# Altium project XH发衣柜.PrjPcb
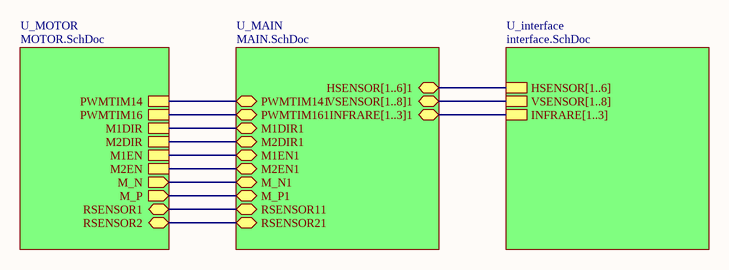
[diagram p0: NETPAGE1.SchDoc]
3 sheets, 77 parts. Net scope: hierarchical (ports join the sheet entries above them; power ports are global).
Board file: XH发衣柜.PcbDoc
Sheets:
  NETPAGE1.SchDoc
    U_MOTOR = MOTOR.SchDoc
    U_MAIN = MAIN.SchDoc

## Sheet NETPAGE1.SchDoc
size A4

### Sub-sheets
U_interface = interface.SchDoc (file not in this document): HSENSOR[1..6], VSENSOR[1..8], INFRARE[1..3]
U_MAIN = MAIN.SchDoc: HSENSOR[1..6]1, VSENSOR[1..8]1, PWMTIM141, PWMTIM161, M1DIR1, M2DIR1, M1EN1, M2EN1, M_N1, M_P1, INFRARE[1..3]1, RSENSOR11, RSENSOR21
U_MOTOR = MOTOR.SchDoc: M2DIR, M1DIR, PWMTIM14, PWMTIM16, M1EN, M2EN, M_N, M_P, RSENSOR1, RSENSOR2

### Nets
M1DIR: sheet U_MOTOR/M1DIR, sheet U_MAIN/M1DIR1
M1EN: sheet U_MOTOR/M1EN, sheet U_MAIN/M1EN1
M2DIR: sheet U_MOTOR/M2DIR, sheet U_MAIN/M2DIR1
M2EN: sheet U_MOTOR/M2EN, sheet U_MAIN/M2EN1
M_N: sheet U_MOTOR/M_N, sheet U_MAIN/M_N1
M_P: sheet U_MOTOR/M_P, sheet U_MAIN/M_P1
PWMTIM14: sheet U_MOTOR/PWMTIM14, sheet U_MAIN/PWMTIM141
PWMTIM16: sheet U_MOTOR/PWMTIM16, sheet U_MAIN/PWMTIM161
RSENSOR1: sheet U_MOTOR/RSENSOR1, sheet U_MAIN/RSENSOR11
RSENSOR2: sheet U_MOTOR/RSENSOR2, sheet U_MAIN/RSENSOR21

### Buses and harness runs
bus sheet U_interface/HSENSOR[1..6] = sheet U_MAIN/HSENSOR[1..6]1
bus sheet U_interface/INFRARE[1..3] = sheet U_MAIN/INFRARE[1..3]1
bus sheet U_interface/VSENSOR[1..8] = sheet U_MAIN/VSENSOR[1..8]1

## Sheet MOTOR.SchDoc
size A3
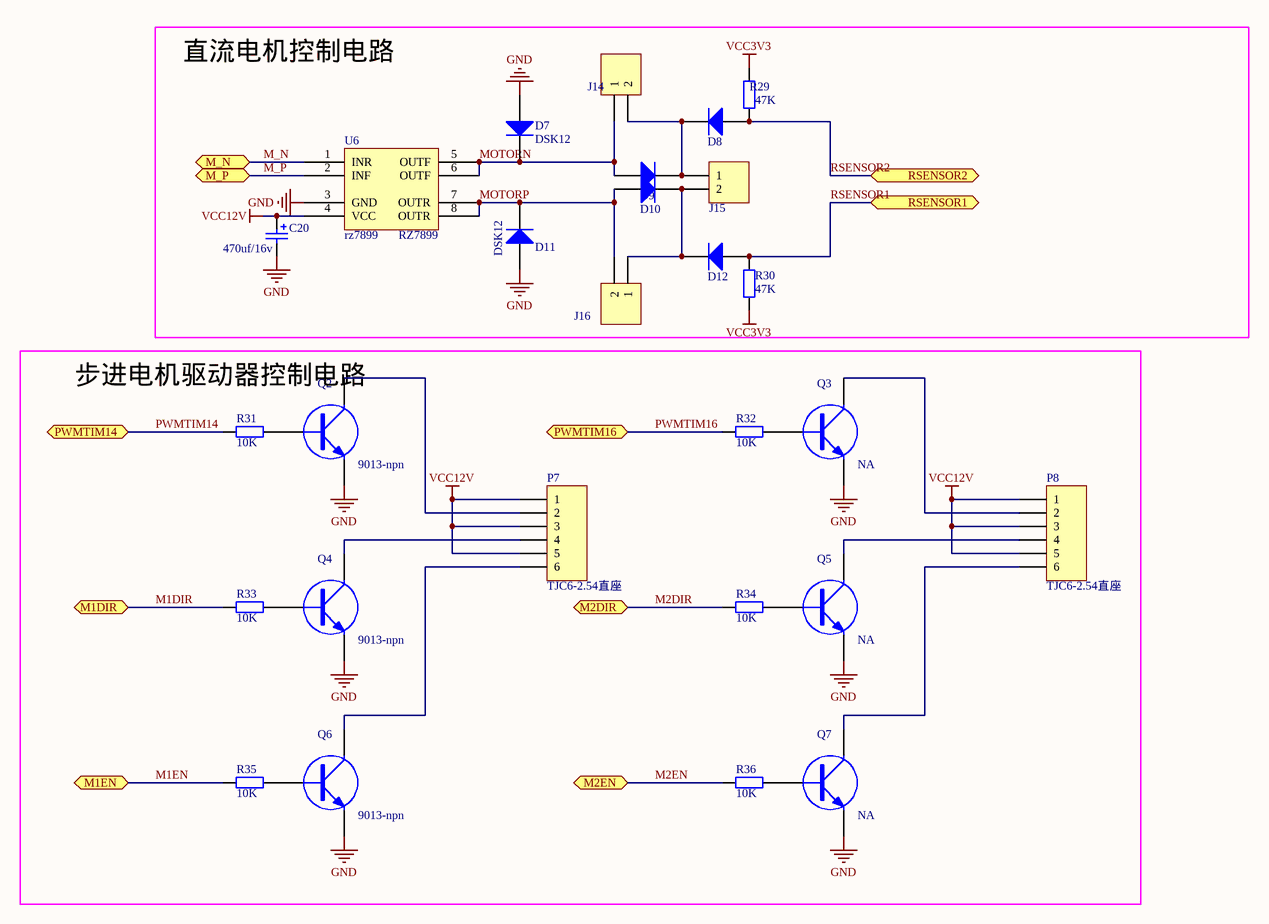
[diagram p1: MOTOR.SchDoc]

### Parts
C20  470uf/16v  [cap_470/16v]
D7  型号: DSK12  [SOD123_D]  (hidden comment: Diode_SOD523)
D8  Diode_SOD323  [SOD323_D]  (value not drawn)
D9  Diode_DO214AB  [SOD123-F]  (value not drawn)
D10  Diode_DO214AB  [SOD123-F]  (value not drawn)
D11  型号: DSK12  [SOD123_D]  (hidden comment: Diode_SOD523)
D12  Diode_SOD323  [SOD323_D]  (value not drawn)
J14  XHB2.54-2PIN-带锁扣  [SIP2]  (value not drawn)
J15  XHB2.54-2PIN-带锁扣  [SIP2]  (value not drawn)
J16  XHB2.54-2PIN-带锁扣  [SIP2]  (value not drawn)
P7  TJC6-2.54直座  [SIP6]
P8  TJC6-2.54直座  [SIP6]
Q2  型号: 9013-npn  [SOT23]  (hidden comment: NPN_SOT23)
Q3  型号: NA  [SOT23]  (hidden comment: NPN_SOT23)
Q4  型号: 9013-npn  [SOT23]  (hidden comment: NPN_SOT23)
Q5  型号: NA  [SOT23]  (hidden comment: NPN_SOT23)
Q6  型号: 9013-npn  [SOT23]  (hidden comment: NPN_SOT23)
Q7  型号: NA  [SOT23]  (hidden comment: NPN_SOT23)
R29  型号: 47K  [0603R]  (hidden comment: Res_0603)
R30  型号: 47K  [0603R]  (hidden comment: Res_0603)
R31  型号: 10K  [0603R]  (hidden comment: Res_0603)
R32  型号: 10K  [0603R]  (hidden comment: Res_0603)
R33  型号: 10K  [0603R]  (hidden comment: Res_0603)
R34  型号: 10K  [0603R]  (hidden comment: Res_0603)
R35  型号: 10K  [0603R]  (hidden comment: Res_0603)
R36  型号: 10K  [0603R]  (hidden comment: Res_0603)
U6  rz7899  [SOP_8]

### Blocks framed on the sheet
直流电机控制电路: C20 D7-D12 J14-J16 R29 R30 U6
步进电机驱动器控制电路: P7 P8 Q2-Q7 R31-R36

### Ports
M1DIR, M1EN, M2DIR, M2EN, M_N, M_P, PWMTIM14, PWMTIM16, RSENSOR1, RSENSOR2

### Nets
GND: C20.2 D7.1 D11.1 Q2.2(E) Q3.2(E) Q4.2(E) Q5.2(E) Q6.2(E) Q7.2(E) U6.3(GND)
VCC3V3: R29.2 R30.1
VCC12V: C20.1 P7.1 P7.3 P7.5 P8.1 P8.3 P8.5 U6.4(VCC)
M1DIR: R33.1 ; port M1DIR
M1EN: R35.1 ; port M1EN
M2DIR: R34.1 ; port M2DIR
M2EN: R36.1 ; port M2EN
M_N: U6.1(INR) ; port M_N
M_P: U6.2(INF) ; port M_P
MOTORN: D7.2 D9.1 J14.1 U6.5(OUTF) U6.6(OUTF)
MOTORP: D10.1 D11.2 J16.2 U6.7(OUTR) U6.8(OUTR)
PWMTIM14: R31.1 ; port PWMTIM14
PWMTIM16: R32.1 ; port PWMTIM16
RSENSOR1: D12.1 R30.2 ; port RSENSOR1
RSENSOR2: D8.1 R29.1 ; port RSENSOR2
NetD8_2: D8.2 D9.2 J14.2 J15.1
NetD10_2: D10.2 D12.2 J15.2 J16.1
NetP7_2: P7.2 Q2.3(C)
NetP7_4: P7.4 Q4.3(C)
NetP7_6: P7.6 Q6.3(C)
NetP8_2: P8.2 Q3.3(C)
NetP8_4: P8.4 Q5.3(C)
NetP8_6: P8.6 Q7.3(C)
NetQ2_1: Q2.1(B) R31.2
NetQ3_1: Q3.1(B) R32.2
NetQ4_1: Q4.1(B) R33.2
NetQ5_1: Q5.1(B) R34.2
NetQ6_1: Q6.1(B) R35.2
NetQ7_1: Q7.1(B) R36.2

### Library data of the parts
C20 = Cap_直插470uf/16v: Polarized Capacitor (Radial); 名称: 贴片电容; 容差: 20%; 型号: 470UF/16V电容; 参考网址: *
D7 D11 = Diode_SOD523: Default Diode; 名称: 贴片二极管; 容差: *
D8 D12 = Diode_SOD323: Default Diode; Published: 8-Jun-2000; LatestRevisionDate: 17-Jul-2002; LatestRevisionNote: Re-released for DXP Platform.; PackageVersion: Sep-1996; PackageReference: SMC; Publisher: Altium Limited; PackageDescription: DO-214-AB/SMC; 2 C-Bend Leads; Body 7.9 x 5.9 mm, inc. leads (LxW); Code_JEDEC: DO-214-AB
D9 D10 = Diode_DO214AB: Default Diode; Published: 8-Jun-2000; LatestRevisionDate: 17-Jul-2002; LatestRevisionNote: Re-released for DXP Platform.; PackageVersion: Sep-1996; PackageReference: SMC; Publisher: Altium Limited; PackageDescription: DO-214-AB/SMC; 2 C-Bend Leads; Body 7.9 x 5.9 mm, inc. leads (LxW); Code_JEDEC: DO-214-AB
J14-J16 = XHB2.54-2P直座: Header, 4-Pin; 名称: 插接件; 容差: *; 参考网址: *; 型号: XHB2.54-2PIN-带锁扣
P7 = TJC6-2.54直座: Header, 6-Pin; 名称: 插接件; 型号: XHB2.54-6PIN-直插锁扣座; 容差: *; 参考网址: https://item.taobao.com/item.htm?spm=a230r.1.14.16.ebb2eb2XgBFau&id=536742831564&ns=1&abbucket=6#detail
P8 = TJC6-2.54直座: Header, 6-Pin; 名称: 插接件; 型号: NA; 容差: *; 参考网址: *
Q2-Q7 = NPN_SOT23: NPN Bipolar Transistor; 名称: 集成电路; 容差: *; 参考网址: *
R29-R36 = Res_0603: Resistor; 名称: 贴片电阻; 容差: 5%; 参考网址: *
U6 = rz7899: 电机驱动芯片3-25V 5A; 名称: 集成芯片; 型号: RZ7899; 容差: *; 参考网址: *

## Sheet MAIN.SchDoc
size A2
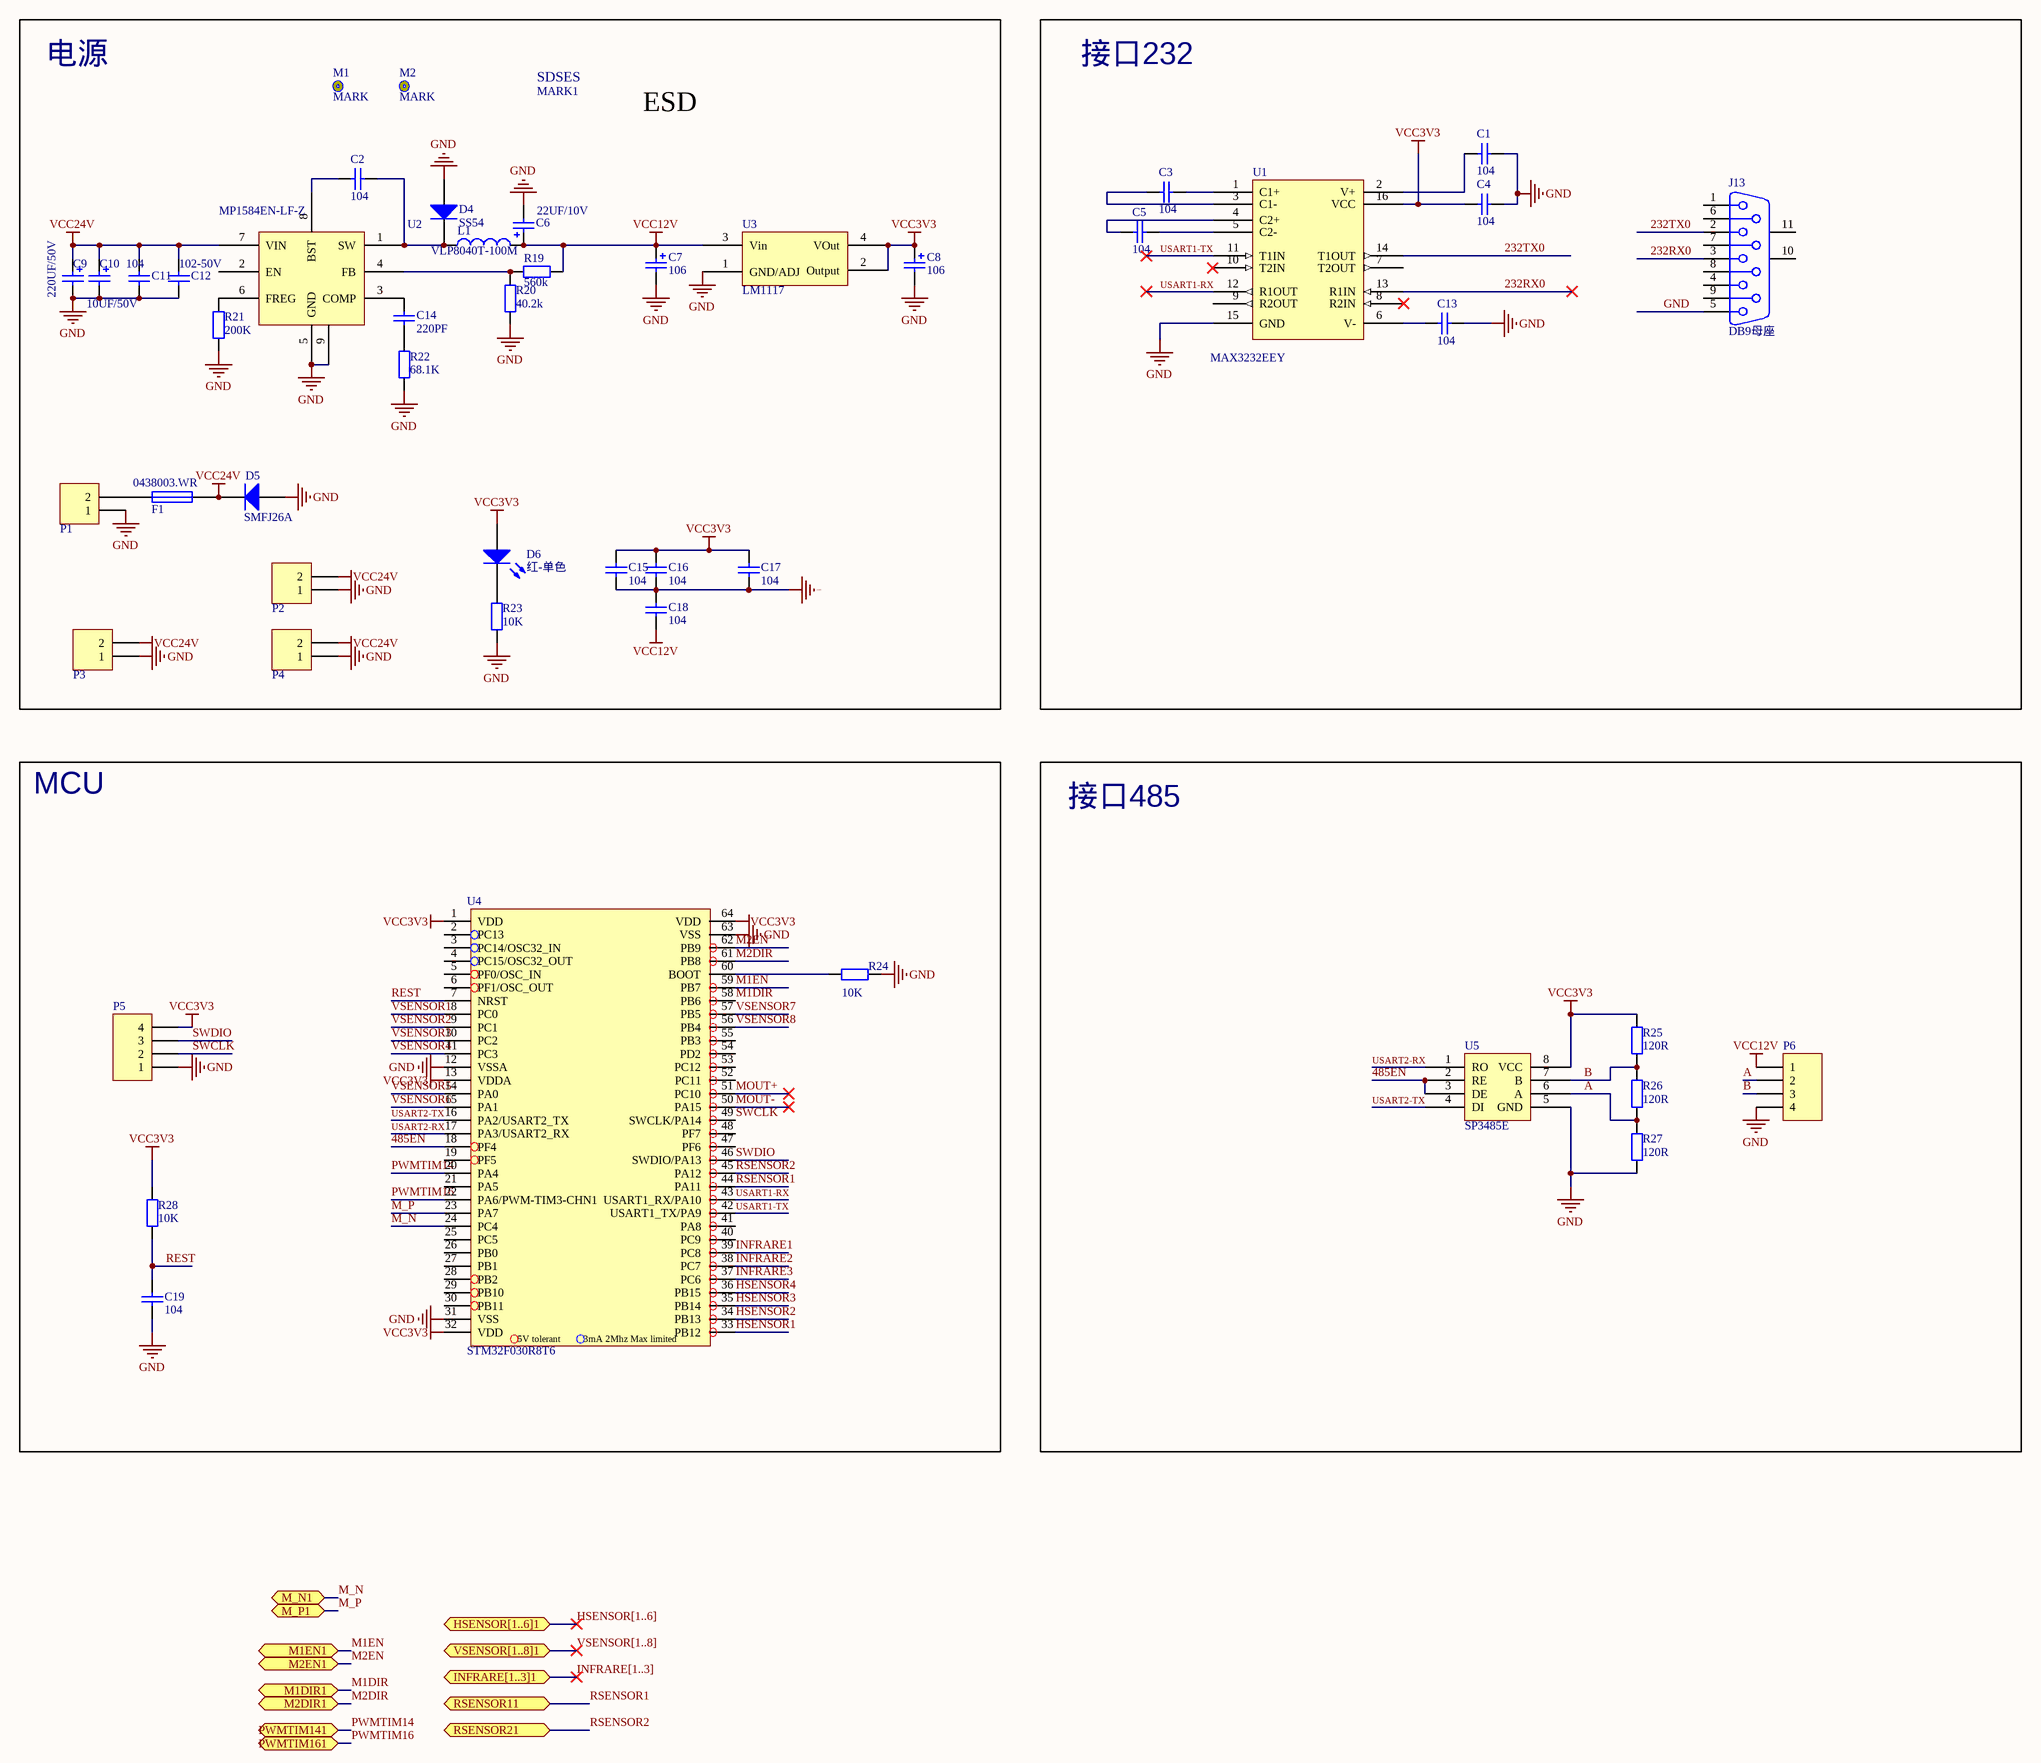
[diagram p2: MAIN.SchDoc]

### Parts
C1  型号: 104  [0603C]  (hidden comment: Cap_0603)
C2  型号: 104  [0603C]  (hidden comment: Cap_0603)
C3  型号: 104  [0603C]  (hidden comment: Cap_0603)
C4  型号: 104  [0603C]  (hidden comment: Cap_0603)
C5  型号: 104  [0603C]  (hidden comment: Cap_0603)
C6  型号: 22UF/10V  [CAP-D0511]  (hidden comment: Cap_贴片电解电容_4*5.4)
C7  型号: 106  [0805C]  (hidden comment: Cap_钽电容B-3528)
C8  型号: 106  [0805C]  (hidden comment: Cap_钽电容B-3528)
C9  型号: 220UF/50V  [CAP-F0811]  (hidden comment: Cap_贴片电解电容_6.3*5.5)
C10  型号: 10UF/50V  [CAP-D0511]  (hidden comment: Cap_贴片电解电容_6.3*5.5)
C11  型号: 104  [0603C]  (hidden comment: Cap_0603)
C12  型号: 102-50V  [0603C]  (hidden comment: Cap_0603)
C13  型号: 104  [0603C]  (hidden comment: Cap_0603)
C14  型号: 220PF  [0603C]  (hidden comment: Cap_0603)
C15  型号: 104  [0603C]  (hidden comment: Cap_0603)
C16  型号: 104  [0603C]  (hidden comment: Cap_0603)
C17  型号: 104  [0603C]  (hidden comment: Cap_0603)
C18  型号: 104  [0603C]  (hidden comment: Cap_0603)
C19  型号: 104  [0603C]  (hidden comment: Cap_0603)
D4  型号: SS54  [DO_214AC_SMA]  (hidden comment: SS/SK-54/34/14)
D5  SMFJ26A  [SOD123-F]
D6  型号: 红-单色  [0603_LED]  (hidden comment: LED3_贴片)
F1  型号: 0438003.WR  [1206R]  (hidden comment: FUSE)
J13  DB9母座  [J_DB9_M_W]
L1  型号: VLP8040T-100M  [8040]  (hidden comment: L-SLF7032)
M1  MARK  [MARK]
M2  MARK  [MARK]
MARK1  SDSES  [SDSES]  (value not drawn)
P1  VH3.96-2-直座  [VH3.96-2-直座]  (value not drawn)
P2  VH3.96-2P  [VH3.96-2-直座]  (value not drawn)
P3  VH3.96-2P  [VH3.96-2-直座]  (value not drawn)
P4  VH3.96-2P  [VH3.96-2-直座]  (value not drawn)
P5  4芯连接线焊接直针2.54  [SIP4_2D54F]  (value not drawn)
P6  XHB2.54-4PIN直座  [SIP4]  (value not drawn)
Q1  ESD  [ESD]  (value not drawn)
R19  型号: 560k  [0603R]  (hidden comment: Res_0603)
R20  型号: 40.2k  [0603R]  (hidden comment: Res_0603)
R21  型号: 200K  [0603R]  (hidden comment: Res_0603)
R22  型号: 68.1K  [0603R]  (hidden comment: Res_0603)
R23  型号: 10K  [0603R]  (hidden comment: Res_0603)
R24  型号: 10K  [0603R]  (hidden comment: Res_0603)
R25  型号: 120R  [0603R]  (hidden comment: Res_0603)
R26  型号: 120R  [0603R]  (hidden comment: Res_0603)
R27  型号: 120R  [0603R]  (hidden comment: Res_0603)
R28  型号: 10K  [0603R]  (hidden comment: Res_0603)
U1  MAX3232EEY  [TSSOP16]
U2  型号: MP1584EN-LF-Z  [SOIC8L]  (hidden comment: MP1584EN)
U3  LM1117  [SOT223]
U4  STM32F030R8T6  [LQFP64]
U5  SP3485E  [SO_8]

### Blocks framed on the sheet
电源: C2 C6-C12 C14-C18 D4-D6 F1 L1 M1 M2 MARK1 P1-P4 Q1 R19-R23 U2 U3
接口232: C1 C3-C5 C13 J13 U1
MCU: C19 P5 R24 R28 U4
接口485: P6 R25-R27 U5

### Ports
HSENSOR[1..6]1, INFRARE[1..3]1, M1DIR1, M1EN1, M2DIR1, M2EN1, M_N1, M_P1, PWMTIM141, PWMTIM161, RSENSOR11, RSENSOR21, VSENSOR[1..8]1

### Nets
GND: C1.2 C4.2 C6.2 C7.2 C8.2 C9.2 C10.2 C11.1 C12.1 C13.2 C15.1 C16.2 C17.1 C18.2 C19.1 D4.1 D5.1 J13.5 P1.1 P2.1 P3.1 P4.1 P5.1 P6.4 R20.1 R21.1 R22.1 R23.1 R24.2 R27.1 U1.15(GND) U2.5(GND) U2.9 U3.1(GND/ADJ) U4.12(VSSA) U4.31(VSS) U4.63(VSS) U5.5(GND)
VCC3V3: C4.1 C8.1 C15.2 C16.1 C17.2 D6.1(A) P5.4 R25.2 R28.2 U1.16(VCC) U3.2(Output) U3.4(VOut) U4.1(VDD) U4.13(VDDA) U4.32(VDD) U4.64(VDD) U5.8(VCC)
VCC12V: C6.1 C7.1 C18.1 L1.2 P6.1 R19.1 U3.3(Vin)
VCC24V: C9.1 C10.1 C11.2 C12.2 D5.2 F1.2 P2.2 P3.2 P4.2 U2.7(VIN)
232RX0: J13.3 U1.13(R1IN)
232TX0: J13.2 U1.14(T1OUT)
485EN: U4.18(PF4) U5.2(RE) U5.3(DE)
A: P6.2 R26.1 R27.2 U5.6(A)
B: P6.3 R25.1 R26.2 U5.7(B)
HSENSOR1: U4.33(PB12)
HSENSOR2: U4.34(PB13)
HSENSOR3: U4.35(PB14)
HSENSOR4: U4.36(PB15)
INFRARE1: U4.39(PC8)
INFRARE2: U4.38(PC7)
INFRARE3: U4.37(PC6)
M1DIR: U4.58(PB6) ; port M1DIR1
M1EN: U4.59(PB7) ; port M1EN1
M2DIR: U4.61(PB8) ; port M2DIR1
M2EN: U4.62(PB9) ; port M2EN1
M_N: U4.24(PC4) ; port M_N1
M_P: U4.23(PA7) ; port M_P1
MOUT+: U4.51(PC10)
MOUT-: U4.50(PA15)
PWMTIM14: U4.20(PA4) ; port PWMTIM141
PWMTIM16: U4.22(PA6/PWM-TIM3-CHN1) ; port PWMTIM161
REST: C19.2 R28.1 U4.7(NRST)
RSENSOR1: U4.44(PA11) ; port RSENSOR11
RSENSOR2: U4.45(PA12) ; port RSENSOR21
SWCLK: P5.2 U4.49(SWCLK/PA14)
SWDIO: P5.3 U4.46(SWDIO/PA13)
USART1-RX: U1.12(R1OUT) U4.43(USART1_RX/PA10)
USART1-TX: U1.11(T1IN) U4.42(USART1_TX/PA9)
USART2-RX: U4.17(PA3/USART2_RX) U5.1(RO)
USART2-TX: U4.16(PA2/USART2_TX) U5.4(DI)
VSENSOR1: U4.8(PC0)
VSENSOR2: U4.9(PC1)
VSENSOR3: U4.10(PC2)
VSENSOR4: U4.11(PC3)
VSENSOR5: U4.14(PA0)
VSENSOR6: U4.15(PA1)
VSENSOR7: U4.57(PB5)
VSENSOR8: U4.56(PB4)
NetC1_1: C1.1 U1.2(V+)
NetC2_1: C2.1 U2.8(BST)
NetC2_2: C2.2 D4.2 L1.1 U2.1(SW)
NetC3_1: C3.1 U1.3(C1-)
NetC3_2: C3.2 U1.1(C1+)
NetC5_1: C5.1 U1.4(C2+)
NetC5_2: C5.2 U1.5(C2-)
NetC13_1: C13.1 U1.6(V-)
NetC14_1: C14.1 R22.2
NetC14_2: C14.2 U2.3(COMP)
NetD6_2: D6.2(K) R23.2
NetF1_1: F1.1 P1.2
NetR19_2: R19.2 R20.2 U2.4(FB)
NetR21_2: R21.2 U2.6(FREG)
NetR24_1: R24.1 U4.60(BOOT)

Not connected (* = marked no-connect by the designer): J13 1 4 6 7 8 9 10(MH1) 11(MH2); U1 7(T2OUT) 8(R2IN)* 9(R2OUT) 10(T2IN)*; U2 2(EN); U4 2(PC13) 3(PC14/OSC32_IN) 4(PC15/OSC32_OUT) 5(PF0/OSC_IN) 6(PF1/OSC_OUT) 19(PF5) 21(PA5) 25(PC5) 26(PB0) 27(PB1) 28(PB2) 29(PB10) 30(PB11) 40(PC9) 41(PA8) 47(PF6) 48(PF7) 52(PC11) 53(PC12) 54(PD2) 55(PB3)

### Buses and harness runs
bus HSENSOR[1..6] = port HSENSOR[1..6]1
bus INFRARE[1..3] = port INFRARE[1..3]1
bus VSENSOR[1..8] = port VSENSOR[1..8]1

### Notes on the sheet
- (in symbol STM32F030R8T6) 5V tolerant; 3mA 2Mhz Max limited

### Library data of the parts
C1-C5 C11 C13-C19 = Cap_0603: 名称: 贴片电容; 容差: 20%; 参考网址: NA
C6 = Cap_贴片电解电容_4*5.4: Polarized Capacitor (Radial); 名称: 插接电解电容; 容差: ±20%; 参考网址: *
C7 C8 = Cap_钽电容B-3528: Polarized Capacitor (Radial); 名称: 贴片电容; 容差: ≤20%; 参考网址: *
C9 C10 = Cap_贴片电解电容_6.3*5.5: Polarized Capacitor (Radial); 名称: 插接电解电容; 容差: ±20%（以内）; 参考网址: *
C12 = Cap_0603: 名称: 贴片电容; 容差: 10%; 参考网址: NA
D4 = SS/SK-54/34/14: Default Diode; 名称: 贴片二极管; 容差: NA; 参考网址: *
D5 = Diode_DO214AC: Default Diode; 名称: 贴片二极管; 容差: NA; 参考网址: C115183; 型号: SMFJ26A
D6 = LED3_贴片: 名称: 贴片LED; 容差: NA; 参考网址: *
F1 = FUSE: 名称: 保险丝; 容差: *; 参考网址: *
J13 = D Connector 9: Receptacle Assembly, 9 Position, Right Angle; 名称: 插接件; 型号: DB9-母座; 容差: NA; 参考网址: *
L1 = L-SLF7032: Inductor; 名称: 贴片电感; 容差: 20%; 参考网址: C107345
P1 = VH3.96-2-直座: 名称: 插接件; 容差: NA; 型号: VH3.96-2-直座; 参考网址: *
P2-P4 = VH3.96-2P: 名称: 插接件; 容差: NA; 型号: VH3.96-2; 参考网址: *
P5 = 4芯连接线带弯焊接针2.54: Header, 4-Pin; 名称: 插接件; 型号: 4PIN直插2.54插针; 容差: NA; 参考网址: *
P6 = XHB2.54-4PIN直座: Header, 4-Pin; 名称: 插接件; 型号: XHB2.54-4PIN直座; 容差: https://item.taobao.com/item.htm?spm=a230r.1.14.16.ebb2eb2XgBFau&id=536742831564&ns=1&abbucket=6#detail; 参考网址: *
Q1 = ESD: ESD MARKER; 名称: MARKER; 型号: ESD; 容差: *; 参考网址: *
R19 R20 = Res_0603: Resistor; 名称: 贴片电阻; 容差: 1%; 参考网址: *
R21-R28 = Res_0603: Resistor; 名称: 贴片电阻; 容差: 5%; 参考网址: *
U1 = MAX3232CSE: TTL/CMOS转RS232; 名称: 集成芯片; 容差: NA; 型号: MAX3232EEY; 参考网址: *
U2 = MP1584EN: 名称: 集成芯片; 容差: NA; 参考网址: *
U3 = LM1117: 名称: 集成芯片; 型号: AMS1117/LM1117-3.3V; 容差: NA; 参考网址: C108494/C71121/C94058
U4 = STM32F030R8T6: 名称: 集成芯片; 容差: *; 参考网址: *; 型号: STM32F030R8T6
U5 = SP485E

## Nets that join several sheets
GND: MOTOR (10 pins), MAIN (38 pins)
VCC3V3: MOTOR (R29.2 R30.1), MAIN (17 pins)
VCC12V: MOTOR (8 pins), MAIN (7 pins)
M1DIR: MOTOR (R33.1), MAIN (U4.58)
M1EN: MOTOR (R35.1), MAIN (U4.59)
M2DIR: MOTOR (R34.1), MAIN (U4.61)
M2EN: MOTOR (R36.1), MAIN (U4.62)
M_N: MOTOR (U6.1), MAIN (U4.24)
M_P: MOTOR (U6.2), MAIN (U4.23)
PWMTIM14: MOTOR (R31.1), MAIN (U4.20)
PWMTIM16: MOTOR (R32.1), MAIN (U4.22)
RSENSOR1: MOTOR (D12.1 R30.2), MAIN (U4.44)
RSENSOR2: MOTOR (D8.1 R29.1), MAIN (U4.45)